# EasyEDA Pro project PicoUSBMotherboardV1.1.eprj, schematic Schematic1
Board Name: Board1; Create Date: 2024-09-13; Page Name: P1; Project Name: PicoUSBMotherboardV1.1; Schematic Name: Schematic1; Update Date: 2024-10-14; Company: EasyEDA.com; Drawn: EasyEDA; Page Size: A4; Part Number: JLCPCB-002; Reviewed: EasyEDA; Version: V0.1
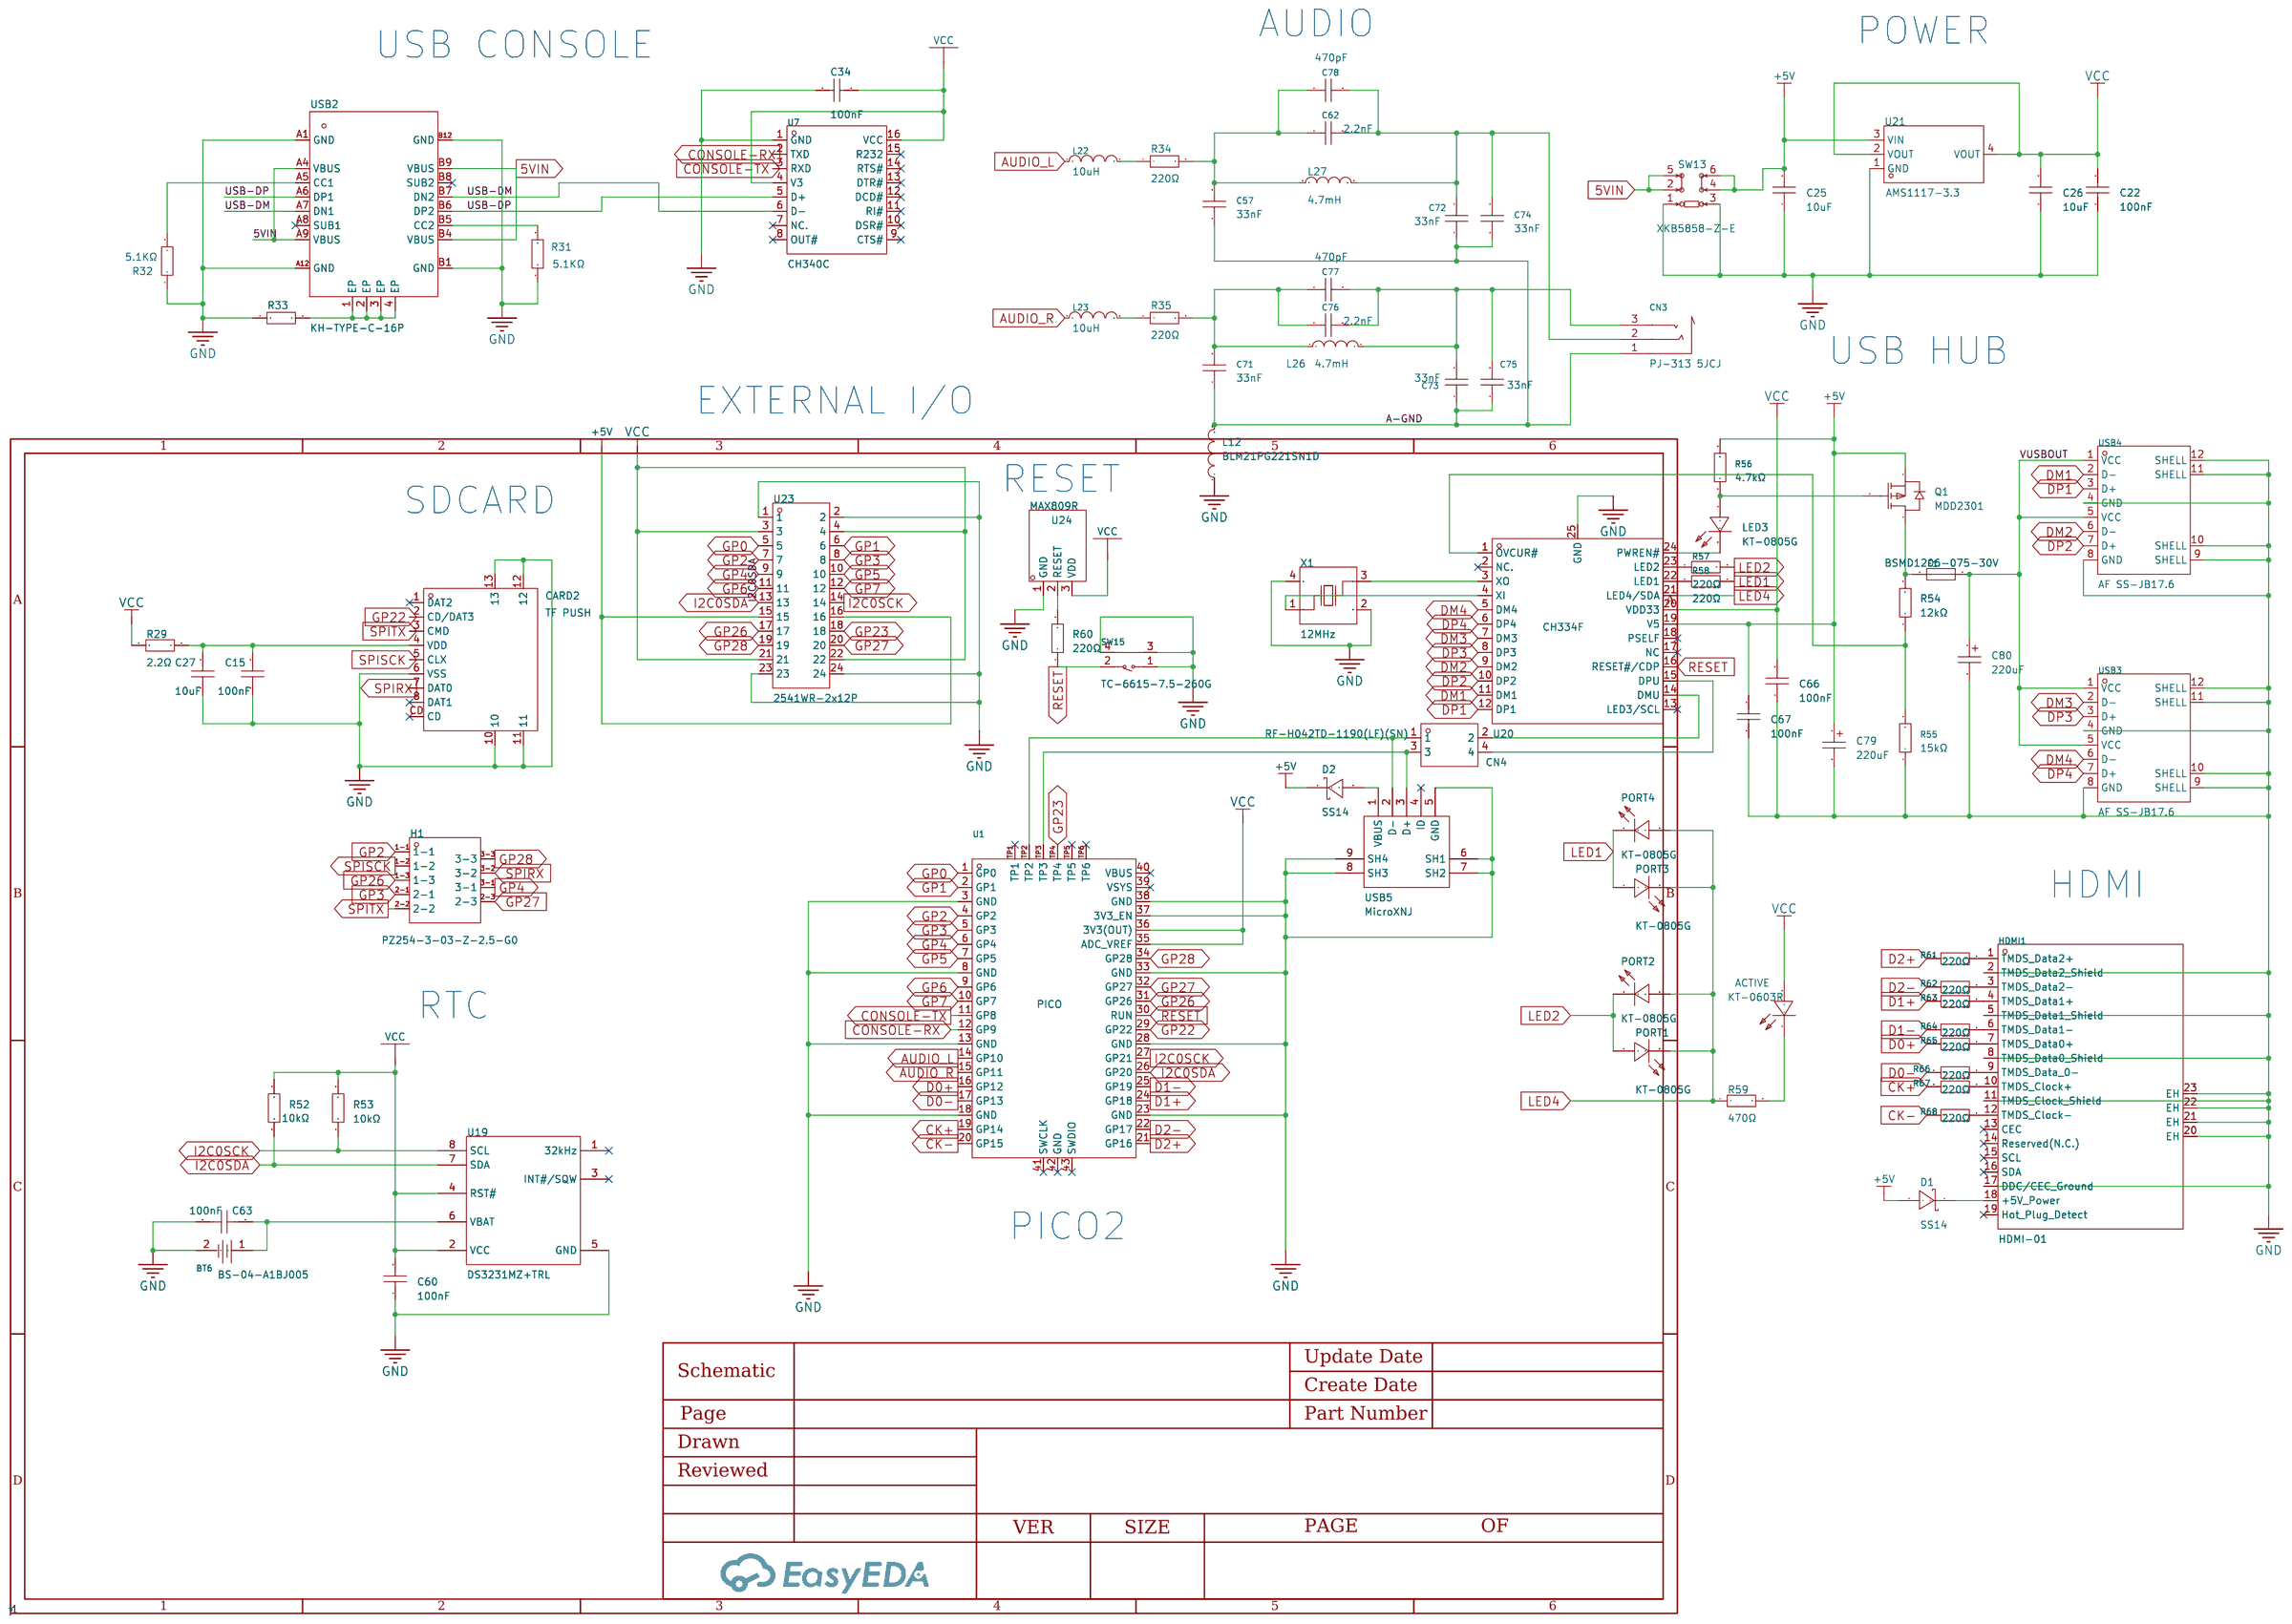
[diagram p0: schematic sheet]

## Parts
ACTIVE  KT-0603R  [LED0603-RD]
BT6  BS-04-A1BJ005  [BAT-TH_BS-04-A1BJ004]
C15  100nF  [C0402_NEW]
C22  100nF  [C0402_NEW]
C25  10uF  [C1206]
C26  10uF  [C1206]
C27  10uF  [C1206]
C34  100nF  [C0402_NEW]
C57  33nF  [C0805]
C60  100nF  [C0402_NEW]
C62  2.2nF  [C0805]
C63  100nF  [C0402]
C66  100nF  [C0402_NEW]
C67  100nF  [C0402_NEW]
C71  33nF  [C0805]
C72  33nF  [C0805]
C73  33nF  [C0805]
C74  33nF  [C0805]
C75  33nF  [C0805]
C76  2.2nF  [C0805]
C77  470pF  [C0603]
C78  470pF  [C0603]
C79  220uF  [CASE-D_7343]
C80  220uF  [CASE-D_7343]
CARD2  TF PUSH  [TF-SMD_TF-PUSH]
CN3  PJ-313 5JCJ  [AUDIO-TH_PJ-313_5JCJ]
CN4  RF-H042TD-1190(LF)(SN)  [HDR-TH_4P-P2.54-V-M-R2-C2-S2.54-1]
D1  SS14  [SMA_L4.2-W2.6-LS5.3-RD]
D2  SS14  [SMA_L4.2-W2.6-LS5.3-RD]
F1  BSMD1206-075-30V  [F1206]
H1  PZ254-3-03-Z-2.5-G0  [HDR-TH_9P-P2.54-V-M-R3-C3-S2.54]
HDMI1  HDMI-01  [USB-SMD_HDMI-01]
L12  BLM21PG221SN1D  [L0805]
L22  10uH  [L0805]
L23  10uH  [L0805]
L26  4.7mH  [IND-SMD_L5.0-W5.0-1]
L27  4.7mH  [IND-SMD_L5.0-W5.0-1]
LED3  KT-0805G  [LED0805-R-RD]
PORT1  KT-0805G  [LED0805-R-RD]
PORT2  KT-0805G  [LED0805-R-RD]
PORT3  KT-0805G  [LED0805-R-RD]
PORT4  KT-0805G  [LED0805-R-RD]
Q1  MDD2301  [SOT-23-3_L2.9-W1.5-P1.90-LS2.6-BL]
R29  2.2Ω  [R0805]
R31  5.1kΩ  [R0402]
R32  5.1kΩ  [R0402]
R33  1MΩ  [R0402]
R34  220Ω  [R0603]
R35  220Ω  [R0603]
R52  10kΩ  [R0805]
R53  10kΩ  [R0805]
R54  12kΩ  [R0603]
R55  15kΩ  [R0603]
R56  4.7kΩ  [R0805]
R57  220Ω  [R0805]
R58  220Ω  [R0805]
R59  470Ω  [R0603]
R60  220Ω  [R0603]
R61  220Ω  [R0603]
R62  220Ω  [R0603]
R63  220Ω  [R0603]
R64  220Ω  [R0603]
R65  220Ω  [R0603]
R66  220Ω  [R0603]
R67  220Ω  [R0603]
R68  220Ω  [R0603]
SW13  XKB5858-Z-E  [SW-TH_XKB5858-Z-E]
SW15  TC-6615-7.5-260G  [SW-TH_4P-L7.5-W7.5-P4.50]
U1  PICO  [COMM-SMD_L51.0-W21.0-P2.54_SC0916]
U7  CH340C  [SOP-16_L10.0-W3.9-P1.27-LS6.0-BL]
U19  DS3231MZ+TRL  [SOIC-8_L4.9-W3.9-P1.27-LS6.0-BL]
U20  CH334F  [QFN-24_L4.0-W4.0-P0.50-BL-EP2.8]
U21  AMS1117-3.3  [SOT-223-3_L6.5-W3.4-P2.30-LS7.0-BR]
U23  2541WR-2x12P  [HDR-TH_24P-P2.54-H-M-R2-C12-S2.54-N]
U24  MAX809R  [SOT-23-3_L2.9-W1.3-P1.90-LS2.4-BR]
USB2  KH-TYPE-C-16P  [USB-C-SMD_KH-TYPE-C-16P]
USB3  AF SS-JB17.6  [USB-A-TH_AF-SS-JB17.6]
USB4  AF SS-JB17.6  [USB-A-TH_AF-SS-JB17.6]
USB5  MicroXNJ  [MICRO-USB-SMD_MICROXNJ]
X1  12MHz  [OSC-SMD_4P-L3.2-W2.5-BL]

## Library data of the parts
ACTIVE = KT-0603R: LCSC Part Name: 0603 红灯 高亮; Supplier Part: C2286; Manufacturer: KENTO; Supplier Footprint: 0603; JLCPCB Part Class: Basic Part; Datasheet: https://atta.szlcsc.com/upload/public/pdf/source/20160616/1466072038404.pdf; Supplier: LCSC; Emitted Color: Red; Operating Temperature: -40℃~+85℃
BT6 = BS-04-A1BJ005: Connector Type:Battery base Battery Type:CR2032 Operating Temperature Range:-25℃~+85℃ Operating Temperature Range:-25℃~+85℃; LCSC Part Name: 电池底座 适用电池:CR2032; Supplier Part: C964751; Manufacturer: MYOUNG(美阳); Supplier Footprint: 插件; JLCPCB Part Class: Extended Part; Datasheet: https://atta.szlcsc.com/upload/public/pdf/source/20201218/C964751_974D973689E162B6ACD63DB51B9F9202.pdf; Supplier: LCSC; Connector Type: Battery base; Battery Type: CR2032; Operating Temperature Range: -25℃~+85℃
C15 C22 C34 C60 C66 C67 = CL05B104KO5NNNC: Capacitance: Tolerance:±10% Tolerance:±10% Voltage Rated: Temperature Coefficient:; LCSC Part Name: 100nF ±10% 16V; Supplier Part: C1525; Manufacturer: SAMSUNG(三星); Supplier Footprint: 0402; JLCPCB Part Class: Basic Part; Datasheet: https://atta.szlcsc.com/upload/public/pdf/source/20160103/1457707674891.pdf; Supplier: LCSC; Tolerance: ±10%
C25-C27 = CL31A106KBHNNNE: Capacitance: Tolerance:±10% Tolerance:±10% Voltage Rated: Temperature Coefficient:; LCSC Part Name: 10uF ±10% 50V; Supplier Part: C13585; Manufacturer: SAMSUNG(三星); Supplier Footprint: 1206; JLCPCB Part Class: Basic Part; Datasheet: https://atta.szlcsc.com/upload/public/pdf/source/20160103/1457707668742.pdf; Supplier: LCSC; Tolerance: ±10%
C57 C71-C75 = 0805B333K500NT: Capacitance:33nF Tolerance:±10% Tolerance:±10% Voltage Rated: Temperature Coefficient:; LCSC Part Name: 33nF ±10% 50V; Supplier Part: C1739; Manufacturer: FH(风华); Supplier Footprint: 0805; JLCPCB Part Class: Basic Part; Datasheet: https://atta.szlcsc.com/upload/public/pdf/source/20200305/C486355_26A10D38EF8C2A5C37091D0039909270.pdf; Supplier: LCSC; Tolerance: ±10%
C62 C76 = CL21C222JBFNNNE: Capacitance: Tolerance:±5% Tolerance:±5% Voltage Rated: Temperature Coefficient:; LCSC Part Name: 2.2nF ±5% 50V; Supplier Part: C28260; Manufacturer: SAMSUNG(三星); Supplier Footprint: 0805; JLCPCB Part Class: Basic Part; Datasheet: https://atta.szlcsc.com/upload/public/pdf/source/20160218/1457707763339.pdf; Supplier: LCSC; Tolerance: ±5%
C63 = CL05B104KB54PNC: Capacitance: Tolerance:±10% Tolerance:±10% Voltage Rated: Temperature Coefficient:; LCSC Part Name: 100nF ±10% 50V; Supplier Part: C307331; Manufacturer: SAMSUNG(三星); Supplier Footprint: 0402; JLCPCB Part Class: Basic Part; Datasheet: https://atta.szlcsc.com/upload/public/pdf/source/20160218/1457707763339.pdf; Supplier: LCSC; Tolerance: ±10%
C77 C78 = 0603B471K500NT: Capacitance: Tolerance:±10% Tolerance:±10% Voltage Rated: Temperature Coefficient:; LCSC Part Name: 470pF ±10% 50V; Supplier Part: C1620; Manufacturer: FH(风华); Supplier Footprint: 0603; JLCPCB Part Class: Basic Part; Datasheet: https://atta.szlcsc.com/upload/public/pdf/source/20200305/C486355_26A10D38EF8C2A5C37091D0039909270.pdf; Supplier: LCSC; Tolerance: ±10%
C79 C80 = TAJD227K010RNJ: LCSC Part Name: 220uF ±10% 10V; Supplier Part: C8024; Manufacturer: Kyocera AVX; Supplier Footprint: CASE-D-7343; JLCPCB Part Class: Extended Part; Datasheet: https://atta.szlcsc.com/upload/public/pdf/source/20160107/1457707750344.pdf; Supplier: LCSC; Tolerance: ±10%; Equivalent Series Resistance(ESR): 500mΩ@100kHz; Operating Temperature: -55℃~+125℃
CARD2 = TF PUSH: Card Type:MicroSD卡(TF卡) Connector Type:卡座 Card Connection Mode:自弹式 Maximum Body Height:2mm Operating Temperature Range:-20℃~+90℃ Operating Temperature Range:-20℃~+90℃; LCSC Part Name: 自弹式TF卡座 TF外焊式内存卡卡座; Supplier Part: C393941; Manufacturer: SHOU HAN(首韩); Supplier Footprint: SMD; JLCPCB Part Class: Extended Part; Datasheet: https://atta.szlcsc.com/upload/public/pdf/source/20191011/C393941_0DDD896EE907FEB750D8B7B8982E2A67.pdf; Supplier: LCSC; Card Type: MicroSD卡(TF卡); Connector Type: 卡座; Card Connection Mode: 自弹式; Maximum Body Height: 2mm; Operating Temperature Range: -20℃~+90℃
CN3 = PJ-313 5JCJ: Connector Type:3.5mm耳机座 Current Rating (Max):- Voltage Rating (Max):- Operating Temperature Range:-20℃~+70℃ Operating Temperature Range:-20℃~+70℃; LCSC Part Name: 3.5mm耳机座; Supplier Part: C668607; Manufacturer: SHOU HAN(首韩); Supplier Footprint: 插件; JLCPCB Part Class: Extended Part; Datasheet: https://atta.szlcsc.com/upload/public/pdf/source/20200618/C668607_FE17687B176711313D54B567644D1F03.pdf; Supplier: LCSC; Connector Type: 3.5mm耳机座; Operating Temperature Range: -20℃~+70℃
CN4 = RF-H042TD-1190(LF)(SN): LCSC Part Name: 间距:2.54mm 2x2P 直插; Supplier Part: C160338; Manufacturer: JST; Supplier Footprint: 插件,P=2.54mm; JLCPCB Part Class: Extended Part; Datasheet: https://atta.szlcsc.com/upload/public/pdf/source/20181010/C265320_ADFEC958DBF71E2955E8BF9D5F374E65.pdf; Supplier: LCSC; Pin Structure: 2x2P; Pitch: 2.54mm; Row Spacing: 2.54mm; Mounting Type: Straight; Number of Rows: 双排; Number of Pins: 4P; Length of Mating Pin: 6mm; Insulation Height: 2.54mm; Length of End Connection Pin: 3.4mm; Operating Temperature Range: -55℃~+125℃; Color: Black
D1 D2 = SS14_C2480: LCSC Part Name: 电压:40V 电流:1A; Supplier Part: C2480; Manufacturer: MDD(辰达半导体); Supplier Footprint: SMA(DO-214AC); JLCPCB Part Class: Basic Part; Datasheet: https://atta.szlcsc.com/upload/public/pdf/source/20230712/2DB6064CFBB99DE6DB116BEE8208BE66.pdf; Supplier: LCSC; Diode Configuration: Single; Forward Voltage (Vf@If): 550mV@1A; Reverse Voltage (Vr): 40V; Rectified Current: 1A; Reverse Leakage Current (Ir): 300uA@40V
F1 = BSMD1206-075-30V: LCSC Part Name: 1206 0.75A 30V 佰宏高电压; Supplier Part: C976305; Manufacturer: BHFUSE(佰宏); Supplier Footprint: 1206; JLCPCB Part Class: Extended Part; Datasheet: https://atta.szlcsc.com/upload/public/pdf/source/20230512/E419278EC8529AAF514173EF221BCF4B.pdf; Supplier: LCSC; Operating Voltage (Max): 30V; Current Rating (Max): 40A; Hold Current: 750mA; Trip Current: 1.5A; Power Dissipation: 800mW; Resistance - Initial (Ri) (Min): 90mΩ; Resistance - Post Trip (R1) (Max): 500mΩ; Maximum Time to Trip: 200ms; Operating Temperature: -40℃~+85℃
H1 = PZ254-3-03-Z-2.5-G0: LCSC Part Name: 3x3P 间距:2.54mm 方针 直插 黑色; Supplier Part: C7429377; Manufacturer: HCTL(华灿天禄); Supplier Footprint: 插件,P=2.54mm; JLCPCB Part Class: Extended Part; Datasheet: https://atta.szlcsc.com/upload/public/pdf/source/20231019/FA993AF7588ADE43F1B4631F14948A48.pdf; Supplier: LCSC; Pin Structure: 3x3P; Pitch: 2.54mm; Row Spacing: 2.54mm; Circluar Pins/Square Pins: Square Pins; Mounting Type: Straight; Number of Rows: 三排; Number of Pins: 9P; Current Rating (Max): 3A; Length of Mating Pin: 6mm; Insulation Height: 2.5mm; Length of End Connection Pin: 3mm; Operating Temperature Range: -40℃~+105℃; Soldering Temperature(Max): 260℃@10S; Color: Black
HDMI1 = HDMI-01: Connector Type:HDMI Gender:Female Number of Pins:19P Mounting Style:卧贴 Number of Rows:- Current Rating (Max):- Operating Temperature Range:- Operating Temperature Range:-; LCSC Part Name: HDMI 母 P数:19P; Supplier Part: C2906135; Manufacturer: HCTL(华灿天禄); Supplier Footprint: SMD; JLCPCB Part Class: Extended Part; Datasheet: https://atta.szlcsc.com/upload/public/pdf/source/20211027/174AF3D22F1FA530D4E3857278AECDA6.pdf; Supplier: LCSC; Connector Type: HDMI; Gender: Female; Number of Pins: 19P; Mounting Style: 卧贴
L12 = BLM21PG221SN1D: Impedance @ Frequency:220Ω@100MHz Tolerance:±25% Tolerance:±25% DC Resistance:45mΩ Current Rating:2A Circuits:1; LCSC Part Name: 单路 0805磁珠 阻抗220Ω@100MHz; Supplier Part: C85840; Manufacturer: muRata(村田); Supplier Footprint: 0805; JLCPCB Part Class: Extended Part; Datasheet: https://atta.szlcsc.com/upload/public/pdf/source/20180326/C118443_3FAC30E9A4F0E6B81275543C61E0685E.pdf; Supplier: LCSC; Impedance @ Frequency: 220Ω@100MHz; Tolerance: ±25%; DC Resistance: 45mΩ; Current Rating: 2A; Circuits: 1
L22 L23 = SDFL2012S100KTF: Inductance: Tolerance:±10% Tolerance:±10% Rated Current: Saturation Current (Isat):- DC Resistance (DCR): Q @ Freq:- Frequency - Self Resonant:- Ratings:; LCSC Part Name: 10uH ±10%; Supplier Part: C1046; Manufacturer: Sunlord(顺络); Supplier Footprint: 0805; JLCPCB Part Class: Basic Part; Datasheet: https://atta.szlcsc.com/upload/public/pdf/source/20231027/097A17DDB71564CE812E62F0F80142C9.pdf; Supplier: LCSC; Tolerance: ±10%
L26 L27 = YNR5040-472M: LCSC Part Name: 4.7mH ±20% 110mA; Supplier Part: C18236331; Manufacturer: YJYCOIN(益嘉源); Supplier Footprint: SMD,5x5mm; JLCPCB Part Class: Extended Part; Datasheet: https://atta.szlcsc.com/upload/public/pdf/source/20231013/805AD09FEE4E3324BEE52C2F5C5CB4A2.pdf; Supplier: LCSC; Tolerance: ±20%; Saturation Current (Isat): 110mA
LED3 PORT1-PORT4 = KT-0805G: LCSC Part Name: 0805 翠绿 高亮; Supplier Part: C2297; Manufacturer: KENTO; Supplier Footprint: 0805; JLCPCB Part Class: Basic Part; Datasheet: https://atta.szlcsc.com/upload/public/pdf/source/20170209/1486607340485.pdf; Supplier: LCSC; Emitted Color: Emerald
Q1 = MDD2301: LCSC Part Name: 1个P沟道 耐压:20V 电流:3A; Supplier Part: C427391; Manufacturer: MDD(辰达半导体); Supplier Footprint: SOT-23; JLCPCB Part Class: Extended Part; Datasheet: https://atta.szlcsc.com/upload/public/pdf/source/20230531/F18836EBBEB51B409D1138221E75ADFA.pdf; Supplier: LCSC; Type: 1个PChannel; Drain Source Voltage (Vdss): 20V; Drain Source On Resistance (RDS(on)@Vgs,Id): 70mΩ@4.5V,3A; Gate Threshold Voltage (Vgs(th)@Id): 700mV@250uA; Total Gate Charge (Qg@Vgs): 6.6nC@2.5V; Input Capacitance (Ciss@Vds): 330pF@10V; Reverse Transfer Capacitance (Crss@Vds): 45pF@10V
R29 = 0805W8F220KT5E: LCSC Part Name: 2.2Ω(2R20) ±1% 编带; Supplier Part: C17521; Manufacturer: UNI-ROYAL(厚声); Supplier Footprint: 0805; JLCPCB Part Class: Basic Part; Datasheet: https://atta.szlcsc.com/upload/public/pdf/source/20170920/C17521_1505887118343979880.pdf; Supplier: LCSC
R31 R32 = 0402WGF5101TCE: Type:Thick Film Resistors Resistance: Tolerance:±1% Tolerance:±1% Power(Watts): Temperature Coefficient:±100ppm/℃ Temperature Coefficient:±100ppm/℃ Overload Voltage (Max): Operating Temperature Range:-55℃~+155℃ Operating Temperature Range:-55℃~+155℃; LCSC Part Name: 5.1KΩ(5101) ±1% 编带; Supplier Part: C25905; Manufacturer: UNI-ROYAL(厚声); Manufacturer Part: 5.1KΩ; Supplier Footprint: 0402; JLCPCB Part Class: Basic Part; Datasheet: https://atta.szlcsc.com/upload/public/pdf/source/20170920/C25905_1505895107382980911.pdf; Supplier: LCSC; Type: Thick Film Resistors; Tolerance: ±1%; Temperature Coefficient: ±100ppm/℃; Operating Temperature Range: -55℃~+155℃
R33 = 0402WGF1004TCE: Type:Thick Film Resistors Resistance: Tolerance:±1% Tolerance:±1% Power(Watts): Temperature Coefficient:±100ppm/℃ Temperature Coefficient:±100ppm/℃ Overload Voltage (Max): Operating Temperature Range:-55℃~+155℃ Operating Temperature Range:-55℃~+155℃; LCSC Part Name: 1MΩ ±1% 62.5mW; Supplier Part: C26083; Manufacturer: UNI-ROYAL(厚声); Supplier Footprint: 0402; JLCPCB Part Class: Basic Part; Datasheet: https://atta.szlcsc.com/upload/public/pdf/source/20200306/C422600_1E6D84923E4A46A82E41ADD87F860B5C.pdf; Supplier: LCSC; Type: Thick Film Resistors; Tolerance: ±1%; Temperature Coefficient: ±100ppm/℃; Operating Temperature Range: -55℃~+155℃
R34 R35 R60-R68 = 0603WAF2200T5E: Type:Thick Film Resistors Resistance: Tolerance:±1% Tolerance:±1% Power(Watts): Temperature Coefficient:±100ppm/℃ Temperature Coefficient:±100ppm/℃ Overload Voltage (Max): Operating Temperature Range:-55℃~+155℃ Operating Temperature Range:-55℃~+155℃; LCSC Part Name: 220Ω ±1% 100mW; Supplier Part: C22962; Manufacturer: UNI-ROYAL(厚声); Supplier Footprint: 0603; JLCPCB Part Class: Basic Part; Datasheet: https://atta.szlcsc.com/upload/public/pdf/source/20200306/C422600_1E6D84923E4A46A82E41ADD87F860B5C.pdf; Supplier: LCSC; Type: Thick Film Resistors; Tolerance: ±1%; Temperature Coefficient: ±100ppm/℃; Operating Temperature Range: -55℃~+155℃
R52 R53 = 0805W8F1002T5E: Type:Thick Film Resistors Resistance: Tolerance:±1% Tolerance:±1% Power(Watts): Temperature Coefficient:±100ppm/℃ Temperature Coefficient:±100ppm/℃ Overload Voltage (Max): Operating Temperature Range:-55℃~+155℃ Operating Temperature Range:-55℃~+155℃; LCSC Part Name: 10kΩ ±1% 125mW; Supplier Part: C17414; Manufacturer: UNI-ROYAL(厚声); Supplier Footprint: 0805; JLCPCB Part Class: Basic Part; Datasheet: https://atta.szlcsc.com/upload/public/pdf/source/20200306/C422600_1E6D84923E4A46A82E41ADD87F860B5C.pdf; Supplier: LCSC; Type: Thick Film Resistors; Tolerance: ±1%; Temperature Coefficient: ±100ppm/℃; Operating Temperature Range: -55℃~+155℃
R54 = 0603WAF1202T5E: LCSC Part Name: 12kΩ ±1% 100mW 厚膜电阻; Supplier Part: C22790; Manufacturer: UNI-ROYAL(厚声); Supplier Footprint: 0603; JLCPCB Part Class: Basic Part; Datasheet: https://atta.szlcsc.com/upload/public/pdf/source/20200306/C422600_1E6D84923E4A46A82E41ADD87F860B5C.pdf; Supplier: LCSC; Type: Thick Film Resistors; Tolerance: ±1%; Temperature Coefficient: ±100ppm/℃; Operating Temperature Range: -55℃~+155℃
R55 = 0603WAF1502T5E: LCSC Part Name: 15kΩ ±1% 100mW 厚膜电阻; Supplier Part: C22809; Manufacturer: UNI-ROYAL(厚声); Supplier Footprint: 0603; JLCPCB Part Class: Basic Part; Datasheet: https://atta.szlcsc.com/upload/public/pdf/source/20200306/C422600_1E6D84923E4A46A82E41ADD87F860B5C.pdf; Supplier: LCSC; Type: Thick Film Resistors; Tolerance: ±1%; Temperature Coefficient: ±100ppm/℃; Operating Temperature Range: -55℃~+155℃
R56 = 0805W8F4701T5E: LCSC Part Name: 4.7kΩ ±1% 125mW 厚膜电阻; Supplier Part: C17673; Manufacturer: UNI-ROYAL(厚声); Supplier Footprint: 0805; JLCPCB Part Class: Basic Part; Datasheet: https://atta.szlcsc.com/upload/public/pdf/source/20200306/C422600_1E6D84923E4A46A82E41ADD87F860B5C.pdf; Supplier: LCSC; Type: Thick Film Resistors; Tolerance: ±1%; Temperature Coefficient: ±100ppm/℃; Operating Temperature Range: -55℃~+155℃
R57 R58 = 0805W8F2200T5E: LCSC Part Name: 220Ω ±1% 125mW 厚膜电阻; Supplier Part: C17557; Manufacturer: UNI-ROYAL(厚声); Supplier Footprint: 0805; JLCPCB Part Class: Basic Part; Datasheet: https://atta.szlcsc.com/upload/public/pdf/source/20200306/C422600_1E6D84923E4A46A82E41ADD87F860B5C.pdf; Supplier: LCSC; Type: Thick Film Resistors; Tolerance: ±1%; Temperature Coefficient: ±100ppm/℃; Operating Temperature Range: -55℃~+155℃
R59 = 0603WAF4700T5E: LCSC Part Name: 470Ω ±1% 100mW 厚膜电阻; Supplier Part: C23179; Manufacturer: UNI-ROYAL(厚声); Supplier Footprint: 0603; JLCPCB Part Class: Basic Part; Datasheet: https://atta.szlcsc.com/upload/public/pdf/source/20200306/C422600_1E6D84923E4A46A82E41ADD87F860B5C.pdf; Supplier: LCSC; Type: Thick Film Resistors; Tolerance: ±1%; Temperature Coefficient: ±100ppm/℃; Operating Temperature Range: -55℃~+155℃
SW13 = XKB5858-Z-E: Contact Current:100mA Voltage Rating (AC):250V Voltage Rating (DC):30V Insulation Resistance:100MΩ Mounting Style:Lying Self Lock / No Lock:LATCHING Actuator Style:Square Plunger Actuator/Cap Color:White With Lamp:No Pin Style:PCPin Operating Force:250gf@; Supplier Part: C780038; Manufacturer: XKB Connectivity(中国星坤); Supplier Footprint: 插件; JLCPCB Part Class: Extended Part; Datasheet: https://atta.szlcsc.com/upload/public/pdf/source/20211011/56D3FA9FC185EAC41365C3B37B684CC1.pdf; Supplier: LCSC; Contact Current: 100mA; Voltage Rating (AC): 250V; Voltage Rating (DC): 30V; Insulation Resistance: 100MΩ; Mounting Style: Lying; Self Lock / No Lock: LATCHING; Actuator Style: Square Plunger; Actuator/Cap Color: White; With Lamp: No; Pin Style: PCPin; Operating Force: 250gf@±50gf; Operating Temperature: -15℃~+55℃; Mechanical Life: 100000
SW15 = TC-6615-7.5-260G: LCSC Part Name: 轻触6*6*7.5支架 插件260g; Supplier Part: C2845276; Manufacturer: HCTL(华灿天禄); Supplier Footprint: 插件; JLCPCB Part Class: Extended Part; Datasheet: https://atta.szlcsc.com/upload/public/pdf/source/20230523/3B07ECEFF69432C539FEAF1B55455C52.pdf; Supplier: LCSC; Circuit: SPST; Operating Force: 260gf; Mounting Style: Lying; Switch Length: 6mm; Switch Width: 6mm; Switch Height: 7.5mm; Strike Gundam: 带支架; Contact Current: 50mA; Voltage Rating (DC): 12V
U1 = PICO: Supplier Part: C7203002; Manufacturer: Raspberry Pi(树莓派); JLCPCB Part Class: Extended Part; Datasheet: https://atta.szlcsc.com/upload/public/pdf/source/20230906/086376002DDC9866828648BC93E51F8B.pdf; Supplier: LCSC
U7 = CH340C: Applications Function:Transceiver Protocol: Data Rate:2Mbps Supply Voltage:3.3V；5V Supply Voltage:3.3V；5V; LCSC Part Name: CH340C USB转串口芯片 CH340; Supplier Part: C84681; Manufacturer: WCH(南京沁恒); Supplier Footprint: SOP-16; JLCPCB Part Class: Extended Part; Datasheet: https://atta.szlcsc.com/upload/public/pdf/source/20200819/C84681_ADBED554CE321879DBD6B1D06488689C.pdf; Supplier: LCSC; Applications Function: Transceiver; Data Rate: 2Mbps; Supply Voltage: 3.3V；5V
U19 = DS3231MZ+TRL: Interface:I2C Operating Voltage:2.3V~5.5V Operating Voltage:2.3V~5.5V Operating Temperature:-40℃~+85℃ Operating Temperature:-40℃~+85℃; Supplier Part: C107410; Manufacturer: ADI(亚德诺)/MAXIM(美信); Supplier Footprint: SOIC-8; JLCPCB Part Class: Extended Part; Datasheet: https://atta.szlcsc.com/upload/public/pdf/source/20170620/1497944726830.pdf; Supplier: LCSC; Interface: I2C; Operating Voltage: 2.3V~5.5V; Operating Temperature: -40℃~+85℃
U20 = CH334F_C5187527: Supplier Part: C5187527; Manufacturer: WCH(南京沁恒); Supplier Footprint: QFN-24(4x4); JLCPCB Part Class: Extended Part; Datasheet: https://atta.szlcsc.com/upload/public/pdf/source/20240313/0A90B4344DBFB1B295B73A4884A13F29.pdf; Supplier: LCSC
U21 = AMS1117-3.3_C6186: Output Type: Output Polarity:Positive Number of Outputs:1 Maximum Input Voltage:- Output Voltage:3.3V~3.3V Output Voltage:3.3V~3.3V Dropout Voltage:1.3V@(800mA) Quiescent Current (Ground Current):- Output Current:1A Power Supply Rejection Ratio (PSRR):72d; LCSC Part Name: 正 Vout=3.3V 1A 72dB@(120Hz); Supplier Part: C6186; Manufacturer: AMS; Supplier Footprint: SOT-223-3; JLCPCB Part Class: Basic Part; Datasheet: https://atta.szlcsc.com/upload/public/pdf/source/20180727/C6186_7A095716F0823C02F1997A905E26C086.pdf; Supplier: LCSC; Output Polarity: Positive; Number of Outputs: 1; Output Voltage: 3.3V~3.3V; Dropout Voltage: 1.3V@(800mA); Output Current: 1A; Power Supply Rejection Ratio (PSRR): 72dB@(120Hz)
U23 = 2541WR-2x12P: LCSC Part Name: 2x12P 间距:2.54mm 弯插; Supplier Part: C5383094; Manufacturer: HanElectricity(瀚源); Supplier Footprint: 弯插,P=2.54mm; JLCPCB Part Class: Extended Part; Datasheet: https://atta.szlcsc.com/upload/public/pdf/source/20230330/FE4D889090FF16F85128307BD79BAA8F.pdf; Supplier: LCSC; Pin Structure: 2x12P; Pitch: 2.54mm; Mounting Type: Right-Angle; Number of Rows: 双排; Number of Pins: 24P; Length of Mating Pin: 6mm; Insulation Height: 2.5mm
U24 = MAX809R: Supplier Part: C347370; Manufacturer: UMW(友台半导体); Supplier Footprint: SOT-23; JLCPCB Part Class: Extended Part; Datasheet: https://atta.szlcsc.com/upload/public/pdf/source/20231109/70FCB8835B3C4291565001D8791320BC.pdf; Supplier: LCSC; ChipType: Voltage detector; Output Type: 推挽; Reset Active Level: 低电平有效; Threshold Voltage: 2.63V; Number of Voltages Monitored: 1; Reset Timeout: 150ms; Operating Temperature: -40℃~+85℃
USB2 = KH-TYPE-C-16P: Connector Type:Type-C Standard:- Gender:Female Number of Contacts:16 Number of Ports:1 Mounting Style:Surface Mount Current Rating - Power (Max):3A Operating Temperature Range:-40℃~+85℃ Operating Temperature Range:-40℃~+85℃; LCSC Part Name: Type-C 母座 卧贴; Supplier Part: C709357; Manufacturer: kinghelm(金航标); Supplier Footprint: SMD; JLCPCB Part Class: Extended Part; Datasheet: https://atta.szlcsc.com/upload/public/pdf/source/20200911/C709357_AA8DCEB38BB20E3035A7ED7AE7667837.pdf; Supplier: LCSC; Connector Type: Type-C; Gender: Female; Number of Contacts: 16; Number of Ports: 1; Mounting Style: Surface Mount; Current Rating - Power (Max): 3A; Operating Temperature Range: -40℃~+85℃
USB3 USB4 = AF SS-JB17.6: Connector Type:Type-A Standard:USB 2.0 Gender:Female Number of Ports:2 Number of Contacts:4P+4P Mounting Style:Right-Angle Current Rating - Power (Max):1.5A Operating Temperature Range:-25℃~+85℃ Operating Temperature Range:-25℃~+85℃; LCSC Part Name: Type-A 母 弯插; Supplier Part: C456021; Manufacturer: SHOU HAN(首韩); Supplier Footprint: 插件; JLCPCB Part Class: Extended Part; Datasheet: https://atta.szlcsc.com/upload/public/pdf/source/20191113/C456021_DAD2CFBF46E609FF6653446337360E6B.pdf; Supplier: LCSC; Connector Type: Type-A; Standard: USB 2.0; Gender: Female; Number of Ports: 2; Number of Contacts: 4P+4P; Mounting Style: Right-Angle; Current Rating - Power (Max): 1.5A; Operating Temperature Range: -25℃~+85℃
USB5 = MicroXNJ: LCSC Part Name: Micro-B 母 卧贴; Supplier Part: C404969; Manufacturer: SHOU HAN(首韩); Supplier Footprint: SMD; JLCPCB Part Class: Extended Part; Datasheet: https://atta.szlcsc.com/upload/public/pdf/source/20220415/2494EDFF499AF6F852F7C820374B6AF3.pdf; Supplier: LCSC; Connector Type: Micro-B; Standard: USB 2.0; Gender: Female; Mounting Style: Horizontal attachment; Number of Contacts: 5P; Number of Ports: 1; Current Rating - Power (Max): 1.8A; Operating Temperature Range: -20℃~+85℃; Rated Voltage (Max): 30V; Connect-Disconnect Life: 5000 Cuts; Core Colour: Black
X1 = X322512MSB4SI: LCSC Part Name: 12MHz ±10ppm 20pF; Supplier Part: C9002; Manufacturer: YXC(扬兴晶振); Supplier Footprint: SMD3225-4P; JLCPCB Part Class: Basic Part; Datasheet: https://atta.szlcsc.com/upload/public/pdf/source/20240329/19D5F850207469550BEB00D7DFEDBC7A.pdf; Supplier: LCSC; Crystal Type: Surface Mount Crystal; Normal temperature Frequency Tolerance: ±10ppm; Frequency Stability(Full temperature range): ±20ppm

## Nets
5VIN: SW13.2 SW13.5 USB2.A4(VBUS) USB2.A9(VBUS) USB2.B4(VBUS) USB2.B9(VBUS)
+5V: C25.2 C67.2 C79.1 D1.2(A) D2.1(K) Q1.2(S) R56.2 SW13.4 SW13.6 U20.19(V5) U21.3(VIN) U23.15 U23.16
GND: BT6.2 C15.1 C22.1 C25.1 C26.1 C27.1 C34.2 C60.1 C63.2 C66.1 C67.1 C79.2 C80.2 CARD2.6(VSS) CARD2.10 CARD2.11 CARD2.12 CARD2.13 HDMI1.2(TMDS_Data2_Shield) HDMI1.5(TMDS_Data1_Shield) HDMI1.8(TMDS_Data0_Shield) HDMI1.11(TMDS_Clock_Shield) HDMI1.17(DDC/CEC_Ground) HDMI1.20(EH) HDMI1.21(EH) HDMI1.22(EH) HDMI1.23(EH) L12.1 R31.1 R32.1 R33.1 R55.1 SW13.1 SW13.3 SW15.1 SW15.3 SW15.4 U1.3(GND) U1.8(GND) U1.13(GND) U1.18(GND) U1.23(GND) U1.28(GND) U1.33(GND) U1.37(3V3_EN) U1.38(GND) U7.1(GND) U19.5(GND) U20.25(GND) U21.1(GND) U23.1 U23.2 U23.23 U23.24 U24.1(GND) USB2.A1(GND) USB2.A12(GND) USB2.B1(GND) USB2.B12(GND) USB3.4(GND) USB3.8(GND) USB3.9(SHELL) USB3.10(SHELL) USB3.11(SHELL) USB3.12(SHELL) USB4.4(GND) USB4.8(GND) USB4.9(SHELL) USB4.10(SHELL) USB4.11(SHELL) USB4.12(SHELL) USB5.5(GND) USB5.6(SH1) USB5.7(SH2) USB5.8(SH3) USB5.9(SH4) X1.2(GND) X1.4(GND)
VCC: ACTIVE.2(A) C22.2 C26.2 C34.1 C60.2 C66.2 R29.2 R52.2 R53.2 U1.35(ADC_VREF) U1.36(3V3(OUT)) U7.4(V3) U7.16(VCC) U19.2(VCC) U19.4(RST#) U20.20(VDD33) U21.2(VOUT) U21.4(VOUT) U23.3 U23.4 U23.21 U23.22 U24.3(VDD)
A-GND: C57.1 C71.1 C72.1 C73.1 C74.1 C75.1 CN3.1 L12.2
AUDIO_L: L22.1 U1.14(GP10)
AUDIO_R: L23.1 U1.15(GP11)
CK+: R67.1 U1.19(GP14)
CK-: R68.1 U1.20(GP15)
CONSOLE-RX: U1.12(GP9) U7.2(TXD)
CONSOLE-TX: U1.11(GP8) U7.3(RXD)
D0+: R65.1 U1.16(GP12)
D0-: R66.1 U1.17(GP13)
D1+: R63.1 U1.24(GP18)
D1-: R64.1 U1.25(GP19)
D2+: R61.1 U1.21(GP16)
D2-: R62.1 U1.22(GP17)
DM1: U20.11(DM1) USB4.2(D-)
DM2: U20.9(DM2) USB4.6(D-)
DM3: U20.7(DM3) USB3.2(D-)
DM4: U20.5(DM4) USB3.6(D-)
DP1: U20.12(DP1) USB4.3(D+)
DP2: U20.10(DP2) USB4.7(D+)
DP3: U20.8(DP3) USB3.3(D+)
DP4: U20.6(DP4) USB3.7(D+)
GP0: U1.1(GP0) U23.5
GP1: U1.2(GP1) U23.6
GP2: H1.1-1 U1.4(GP2) U23.7
GP3: H1.2-1 U1.5(GP3) U23.8
GP4: H1.3-1 U1.6(GP4) U23.9
GP5: U1.7(GP5) U23.10
GP6: U1.9(GP6) U23.11
GP7: U1.10(GP7) U23.12
GP22: CARD2.2(CD/DAT3) U1.29(GP22)
GP23: U1.TP4 U23.18
GP26: H1.1-3 U1.31(GP26) U23.17
GP27: H1.2-3 U1.32(GP27) U23.20
GP28: H1.3-3 U1.34(GP28) U23.19
I2C0SCK: R53.1 U1.27(GP21) U19.8(SCL) U23.14
I2C0SDA: R52.1 U1.26(GP20) U19.7(SDA) U23.13
LED1: PORT3.1(A) PORT4.2(K) R58.2
LED2: PORT1.1(A) PORT2.2(K) R57.2
LED4: PORT1.2(K) PORT2.1(A) PORT3.2(K) PORT4.1(A) R59.1 U20.21(LED4/SDA)
RESET: R60.1 SW15.2 U1.30(RUN) U20.16(RESET#/CDP)
SPIRX: CARD2.7(DAT0) H1.3-2
SPISCK: CARD2.5(CLX) H1.1-2
SPITX: CARD2.3(CMD) H1.2-2
USB-DM: U7.6(D-) USB2.A7(DN1) USB2.B7(DN2)
USB-DP: U7.5(D+) USB2.A6(DP1) USB2.B6(DP2)
VUSBOUT: C80.1 F1.2 USB3.1(VCC) USB3.5(VCC) USB4.1(VCC) USB4.5(VCC)
$1N1726: C15.2 C27.2 CARD2.4(VDD) R29.1
$1N2125: R31.2 USB2.B5(CC2)
$1N2134: R32.2 USB2.A5(CC1)
$1N2136: R33.2 USB2.1(EP) USB2.2(EP) USB2.3(EP) USB2.4(EP)
$1N3404: BT6.1 C63.1 U19.6(VBAT)
$1N4723: U20.3(XO) X1.3(OSC2)
$1N4727: U20.4(XI) X1.1(OSC1)
$1N5731: LED3.2(K) U20.24(PWREN#)
$1N5735: LED3.1(A) Q1.1(G) R56.1
$1N5984: R54.1 R55.2 U20.1(OVCUR#)
$1N6229: R57.1 U20.23(LED2)
$1N6268: R58.1 U20.22(LED1)
$1N6542: F1.1 Q1.3(D) R54.2
$1N6846: ACTIVE.1(K) R59.2
$1N9100: R60.2 U24.2(RESET)
$1N9960: L22.2 R34.1
$1N9961: L23.2 R35.1
$1N9963: C57.2 C62.1 C78.1 L27.1 R34.2
$1N9965: C71.2 C76.1 C77.1 L26.1 R35.2
$1N12629: D1.1(K) HDMI1.18(+5V_Power)
$1N12872: C62.2 C72.2 C74.2 C78.2 CN3.2 L27.2
$1N15318: C73.2 C75.2 C76.2 C77.2 CN3.3 L26.2
$1N15400: CN4.4 U20.15(DPU)
$1N15404: CN4.3 U1.TP3 USB5.3(D+)
$1N15409: CN4.2 U20.14(DMU)
$1N15413: CN4.1 U1.TP2 USB5.2(D-)
$1N19302: D2.2(A) USB5.1(VBUS)
$1N22005: HDMI1.1(TMDS_Data2+) R61.2
$1N22047: HDMI1.3(TMDS_Data2-) R62.2
$1N22089: HDMI1.4(TMDS_Data1+) R63.2
$1N22131: HDMI1.6(TMDS_Data1-) R64.2
$1N22173: HDMI1.7(TMDS_Data0+) R65.2
$1N22252: HDMI1.10(TMDS_Clock+) R67.2
$1N22294: HDMI1.12(TMDS_Clock-) R68.2
$1N22336: HDMI1.9(TMDS_Data_0-) R66.2

Not connected (* = marked no-connect by the designer): CARD2 1(DAT2)* 8(DAT1)* CD*; HDMI1 13(CEC)* 14(Reserved(N.C.))* 15(SCL)* 16(SDA)* 19(Hot_Plug_Detect)*; U1 39(VSYS)* 40(VBUS)* 41(SWCLK)* 42(GND)* 43(SWDIO)* TP1* TP5* TP6*; U7 7(NC.)* 8(OUT#)* 9(CTS#)* 10(DSR#)* 11(RI#)* 12(DCD#)* 13(DTR#)* 14(RTS#)* 15(R232)*; U19 1(32kHz)* 3(INT#/SQW)*; U20 2(NC.)* 13(LED3/SCL)* 17(NC)* 18(PSELF)*; USB2 A8(SUB1)* B8(SUB2)*; USB5 4(ID)*

## Notes on the sheet
- AUDIO
- USB CONSOLE
- POWER
- USB HUB
- EXTERNAL I/O
- RESET
- SDCARD
- HDMI
- RTC
- PICO2
